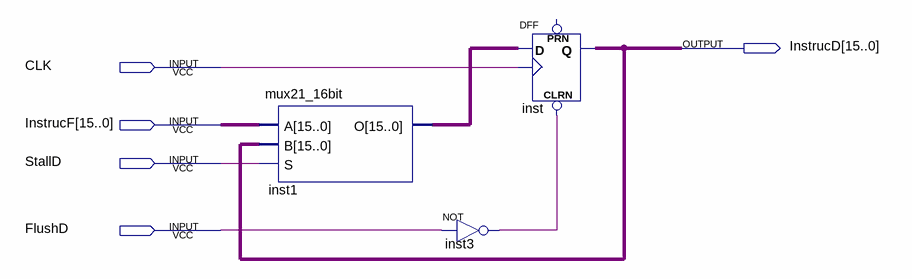
[diagram p0: schematic sheet]
// Quartus schematic IF_ID.bdf as structural Verilog: 3 symbols, 5 pins
module IF_ID (
  input  CLK,
  input  [15:0] InstrucF,
  input  StallD,
  input  FlushD,
  output [15:0] InstrucD
);

  wire inst3_out;
  wire [15:0] inst1_o;

  mux21_16bit inst1 (.A(InstrucF), .B(InstrucD), .S(StallD), .O(inst1_o));
  not inst3 (inst3_out, FlushD);
  DFF inst[15:0] (.CLRN(inst3_out), .CLK(CLK), .D(inst1_o), .Q(InstrucD));  // open: PRN
endmodule
